# Altium schematic sheet led_pack32_touch.SchDoc
size A4
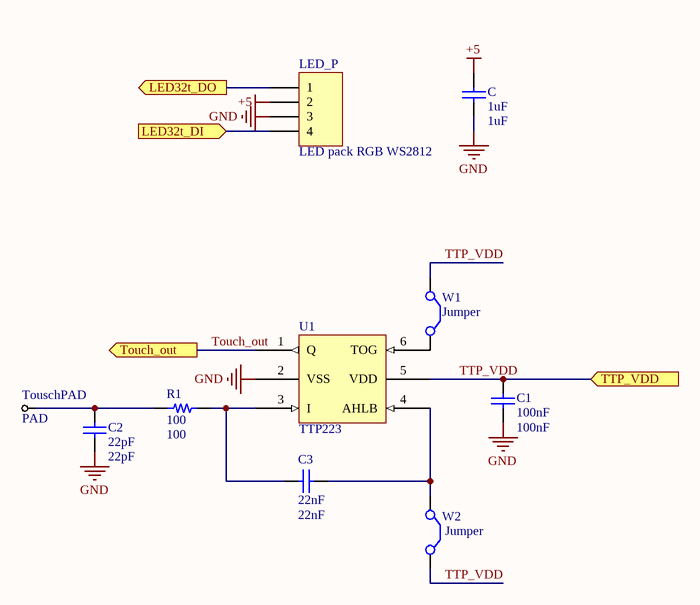
[diagram p0: led_pack32_touch.SchDoc]

## Parts
C  1uF  [0603C]
C1  100nF  [0603C]
C2  22pF  [0603C]
C3  22nF  [0603C]
LED_P  LED pack RGB WS2812  [PACK32-2121]  (no BOM)
PAD  TouschPAD  [touchPAD4]  (no BOM)
R1  100  [0603R]
U1  TTP223  [SOT23-6_L]
W1  Jumper  [JUMPER]  (no BOM)
W2  Jumper  [JUMPER]  (no BOM)

## Ports
LED32t_DI (in), LED32t_DO (out), Touch_out (out), TTP_VDD (in)

## Nets
+5: C.2 LED_P.2
GND: C.1 C1.1 C2.1 LED_P.3 U1.2(VSS)
LED32t_DI: LED_P.4 ; port LED32t_DI
LED32t_DO: LED_P.1 ; port LED32t_DO
Touch_out: U1.1(Q) ; port Touch_out
TTP_VDD: C1.2 U1.5(VDD) W1.1(C1) W2.2(C2) ; port TTP_VDD
NetC2_2: C2.2 PAD.1(T) R1.2
NetC3_1: C3.1 U1.4(AHLB) W2.1(C1)
NetC3_2: C3.2 R1.1 U1.3(I)
NetU1_6: U1.6(TOG) W1.2(C2)

## Library data of the parts
C C1 = Cap: CAP SMD 0603; Published: 8-Jun-2000; LatestRevisionDate: 17-Jul-2002; LatestRevisionNote: Re-released for DXP Platform.; PackageReference: RAD-0.3; Publisher: Altium Limited; PackageDescription: Radial Cap, Thru-Hole; 2 Leads; 0.3 in Pin Spacing
  C: Value: 1uF
  C1: Value: 100nF
C2 C3 = Cap: X7R_NPO; Published: 8-Jun-2000; LatestRevisionDate: 17-Jul-2002; LatestRevisionNote: Re-released for DXP Platform.; PackageReference: RAD-0.3; Publisher: Altium Limited; PackageDescription: Radial Cap, Thru-Hole; 2 Leads; 0.3 in Pin Spacing
  C2: Value: 22pF
  C3: Value: 22nF
LED_P = Header 4: 8 32mm RGB LED pack; LatestRevisionDate: 17-Jul-2002; LatestRevisionNote: Re-released for DXP Platform.; Publisher: Altium Limited
PAD = Test Point
R1 = Resistor: RES SMD 0603; Part Number: RCS0805100KFKEA; Value: 100
U1 = ttp223b: capacitive touch IC
W1 W2 = Jumper: Jumper Wire; Published: 24-Mar-1999; LatestRevisionDate: 17-Jul-2002; LatestRevisionNote: Re-released for DXP Platform.; PackageReference: RAD-0.2; Publisher: Altium Limited; PackageDescription: Radial Cap, Thru-Hole; 2 Leads; 0.2 in Pin Spacing